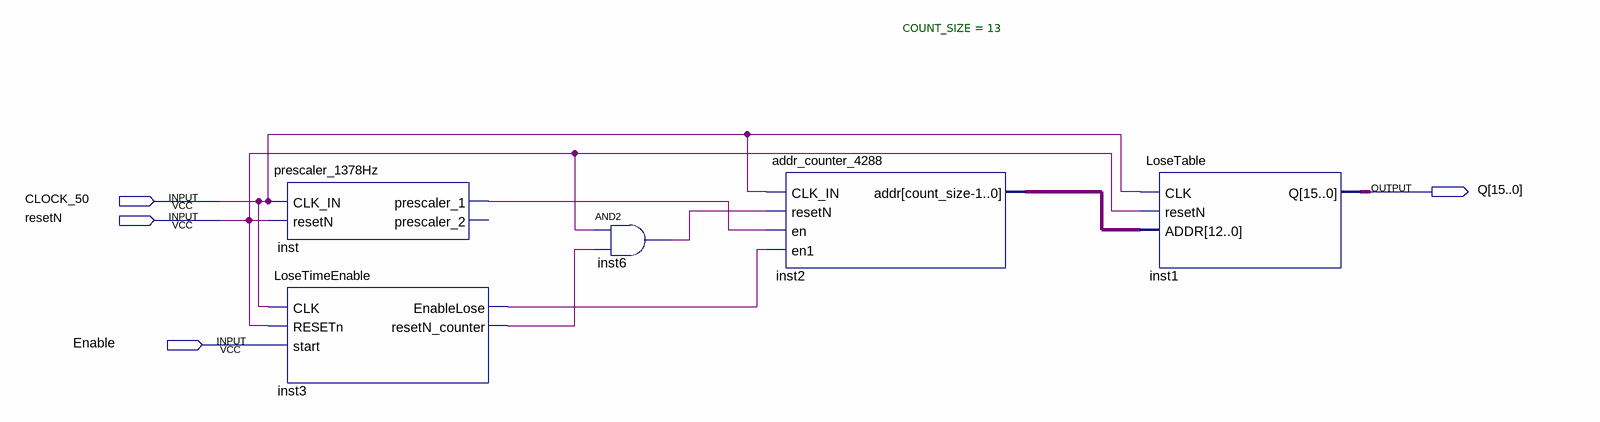
[diagram p0: schematic sheet]
// Quartus schematic LoseSound.bdf as structural Verilog: 5 symbols, 4 pins
module LoseSound (
  input  CLOCK_50,
  input  resetN,
  input  Enable,
  output [15:0] Q
);

  wire inst3_enablelose, inst3_resetn_counter, inst6_out, inst_prescaler_1;
  wire [12:0] inst2_addr;

  prescaler_1378Hz inst (.CLK_IN(CLOCK_50), .resetN(resetN), .prescaler_1(inst_prescaler_1));  // open: prescaler_2
  LoseTimeEnable inst3 (
    .CLK(CLOCK_50), .RESETn(resetN), .start(Enable), .EnableLose(inst3_enablelose),
    .resetN_counter(inst3_resetn_counter));
  and inst6 (inst6_out, resetN, inst3_resetn_counter);
  addr_counter_4288 #(.COUNT_SIZE(13)) inst2 (
    .CLK_IN(CLOCK_50), .resetN(inst6_out), .en(inst_prescaler_1), .en1(inst3_enablelose), .addr(inst2_addr));
  LoseTable inst1 (.CLK(CLOCK_50), .resetN(resetN), .ADDR(inst2_addr), .Q(Q));
endmodule
